# EAGLE design cnc lcd buttons sch (EAGLE 8.4.0)
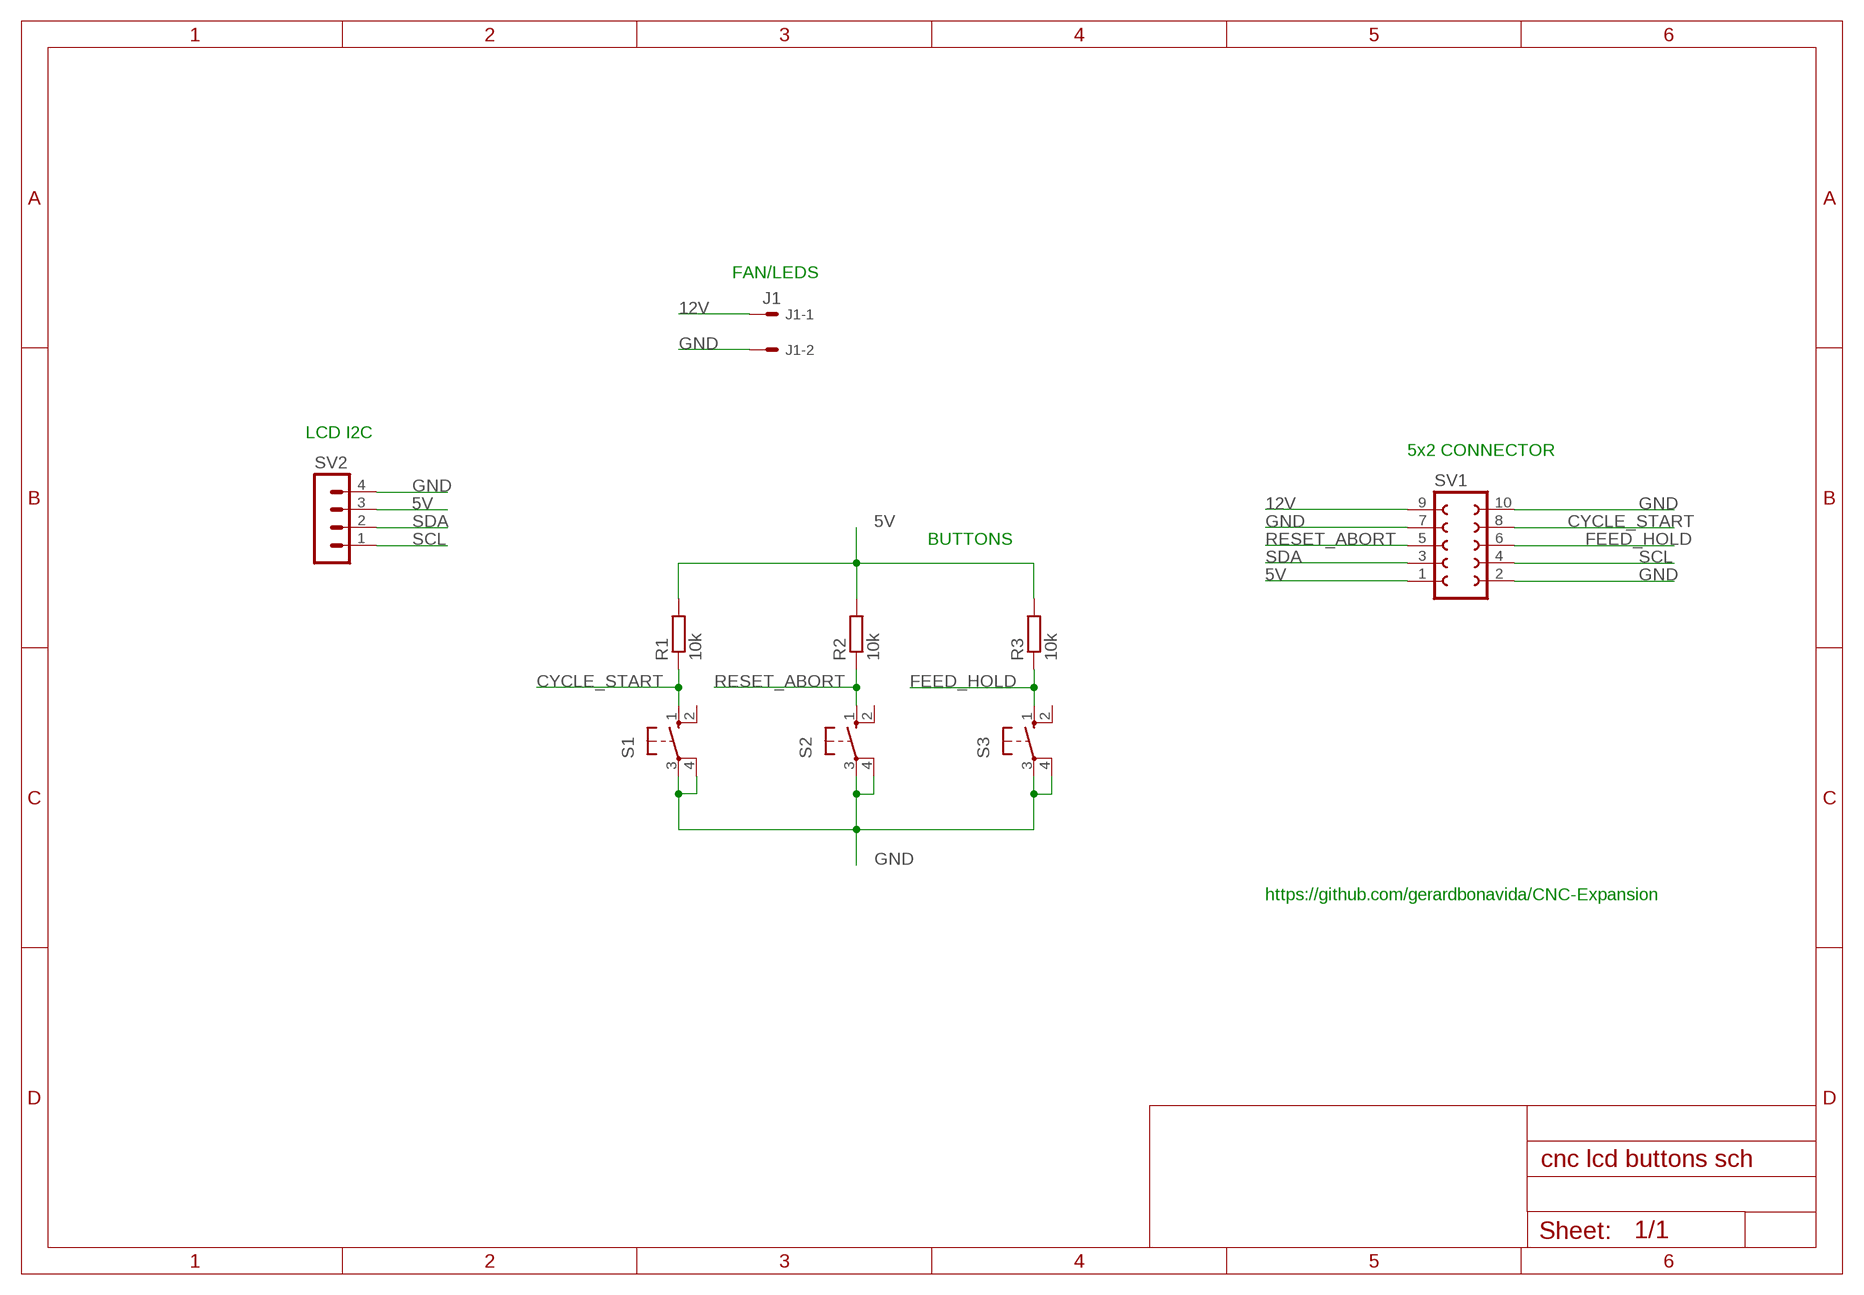
[diagram p0: schematic, sheet 1]

## Parts
J1  J1  22-27-2021-02  [6410-02]
R1  10k  R-EU_0309/12  [0309/12]
R2  10k  R-EU_0309/12  [0309/12]
R3  10k  R-EU_0309/12  [0309/12]
S1  10-XX  [B3F-10XX]
S2  10-XX  [B3F-10XX]
S3  10-XX  [B3F-10XX]
SV1  FE05-2  [FE05-2]
SV2  MA04-1  [MA04-1]

## Nets
5V: R1.2 R2.2 R3.2 SV1.1 SV2.3
12V: J1.1 SV1.9
CYCLE_START: R1.1 S1.1(S) SV1.8
FEED_HOLD: R3.1 S3.1(S) SV1.6
GND: J1.2 S1.3(P) S1.4(P1) S2.3(P) S2.4(P1) S3.3(P) S3.4(P1) SV1.2 SV1.7 SV1.10 SV2.4
RESET_ABORT: R2.1 S2.1(S) SV1.5
SCL: SV1.4 SV2.1
SDA: SV1.3 SV2.2
Unconnected: S1.2(S1) S2.2(S1) S3.2(S1)

## Notes on the sheet
- FAN/LEDS
- LCD I2C
- 5x2 CONNECTOR
- BUTTONS
- https://github.com/gerardbonavida/CNC-Expansion

## Library data of the parts
J1 = con-molex:22-?-02: CONNECTOR wire to board 2.54 mm (.1 inch) pitch header; OC_FARNELL: unknown; OC_NEWARK: unknown
R1-R3 = rcl:R-EU_: RESISTOR, European symbol
S1-S3 = switch-omron:10-XX: OMRON SWITCH; MPN: B3F-1000; OC_FARNELL: 176432; OC_NEWARK: 36M3542
SV1 = con-lsta:FE05-2: FEMALE HEADER; OC_FARNELL: unknown; OC_NEWARK: unknown
SV2 = con-lstb:MA04-1: PIN HEADER; OC_FARNELL: unknown; OC_NEWARK: unknown

## Board
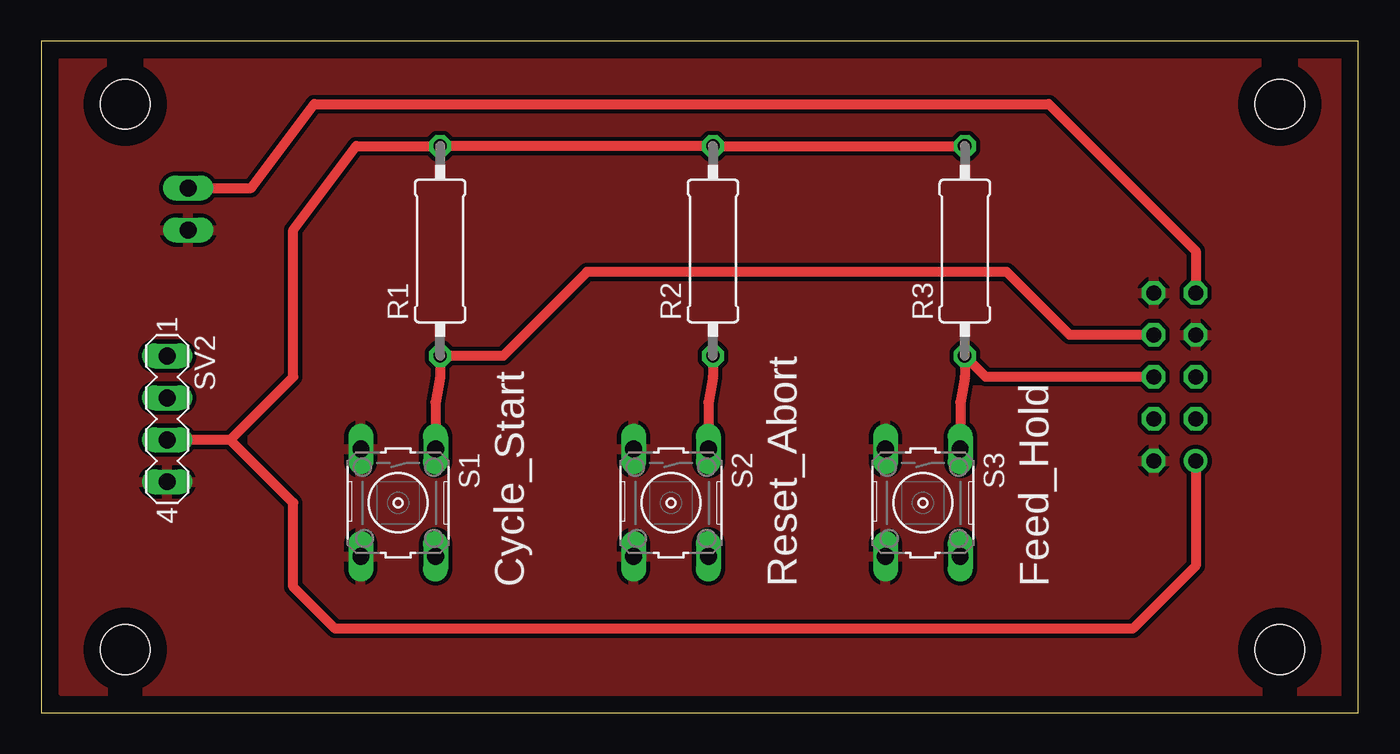
[diagram p1: board, top side]
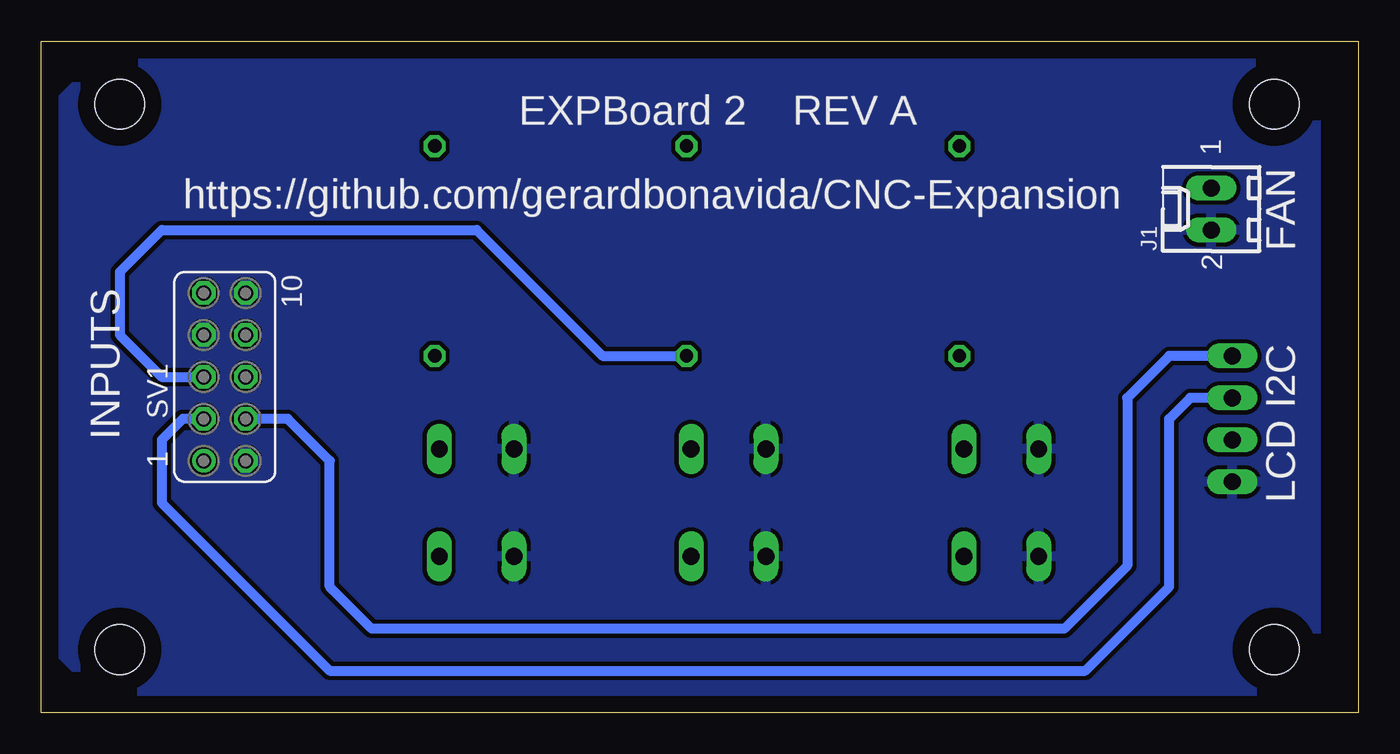
[diagram p2: board, bottom side, seen from below]

Size 79.68 x 40.63 mm. Coordinates in mm from the lower left corner, seen from the top.
Outline: 0,0 79.68,0 79.68,40.63 0,40.63 0,0
Copper layers (1*16): Top 0.035mm / dielectric 1.5mm / Bottom 0.035mm
Design rules "default": minimum track width 6mil, minimum drill 0.35mm, track to track 6mil, track to pad 6mil, pad to pad 6mil, via to via 6mil, smd to smd 6mil, copper to edge 40mil, drill to drill 6mil, minimum pad ring 10mil, minimum via ring 8mil, stop-mask expansion 4mil, vias tented up to drill 0mil, thermal gap 10mil
Holes 3 mm at 5.08,36.83 5.08,3.81 74.93,3.81 74.93,36.83

### Footprints (pad centres in the part's own frame; a part is rotated, then mirrored left to right if it is on the bottom)
6410-02 = drill 1.016 long: 1 1.27,0; 2 -1.27,0
0309/12 = drill 0.813 octagon: 1 -6.35,0; 2 6.35,0
B3F-10XX = drill 1.016 long: 1 -3.251,2.261; 2 3.251,2.261; 3 -3.251,-2.261; 4 3.251,-2.261
FE05-2 = drill 0.914: 1 -5.08,1.27 | drill 0.914 octagon: 2 -5.08,-1.27; 3 -2.54,1.27; 4 -2.54,-1.27; 5 0,1.27; 6 0,-1.27; 7 2.54,1.27; 8 2.54,-1.27; 9 5.08,1.27; 10 5.08,-1.27
MA04-1 = drill 1.016 long: 1 -3.81,0; 2 -1.27,0; 3 1.27,0; 4 3.81,0

### Placement (x,y rotation side)
J1  8.89,30.48 90 bottom
R1  24.13,27.94 90 top
R2  40.64,27.94 90 top
R3  55.88,27.94 90 top
S1  21.59,12.7 270 top
S2  38.1,12.7 270 top
S3  53.34,12.7 270 top
SV1  68.58,20.32 90 bottom
SV2  7.62,17.78 270 top

### Tracks (layer width: path | path; a pad name or v marks a point on that pad's centre or on a via)
5V
  Top 0.61: 11.43,16.51 SV2.3 | 11.43,16.51 15.24,20.32 15.24,29.21 19.05,34.29 R1.2 R2.2 R3.2 | SV1.1 69.85,8.89 66.04,5.08 33.02,5.08 17.78,5.08 15.24,7.62 15.24,12.7 11.43,16.51
12V
  Top 0.61: J1.1 12.7,31.75 16.51,36.83 60.96,36.83 69.85,27.94 SV1.9
CYCLE_START
  Top 0.61: S1.1 23.85,18.77 24.13,20.32 R1.1 27.94,21.59 33.02,26.67 58.42,26.67 62.23,22.86 SV1.8
FEED_HOLD
  Top 0.61: S3.1 55.6,18.77 55.88,20.32 R3.1 57.15,20.32 SV1.6
GND
  Top 0.305: 19.33,8.89 S1.4
  pour Top (isolate 0.254): 1.27,1.27 1.27,39.37 78.74,39.37 78.74,1.27
  pour Bottom (isolate 0.254): 2.54,1.27 2.54,39.37 76.2,39.37 78.74,36.83 78.74,3.81 76.2,1.27
RESET_ABORT
  Top 0.61: R2.1 40.64,20.32 40.36,18.77 S2.1
  Bottom 0.61: SV1.5 72.39,20.32 74.93,22.86 74.93,26.67 72.39,29.21 53.34,29.21 45.72,21.59 R2.1
SCL
  Bottom 0.61: SV2.1 11.43,21.59 13.97,19.05 13.97,8.89 17.78,5.08 59.69,5.08 62.23,7.62 62.23,15.24 64.77,17.78 SV1.4
SDA
  Bottom 0.61: SV2.2 10.16,19.05 11.43,17.78 11.43,7.62 16.51,2.54 62.23,2.54 72.39,12.7 72.39,16.51 71.12,17.78 SV1.3

### Text on the board
tNames: Cycle_Start | Reset_Abort | Feed_Hold
bNames: EXPBoard 2 REV A | https://github.com/gerardbonavida/CNC-Expansion | FAN | INPUTS | LCD I2C